# EAGLE design Project Sch (EAGLE 7.5.0)
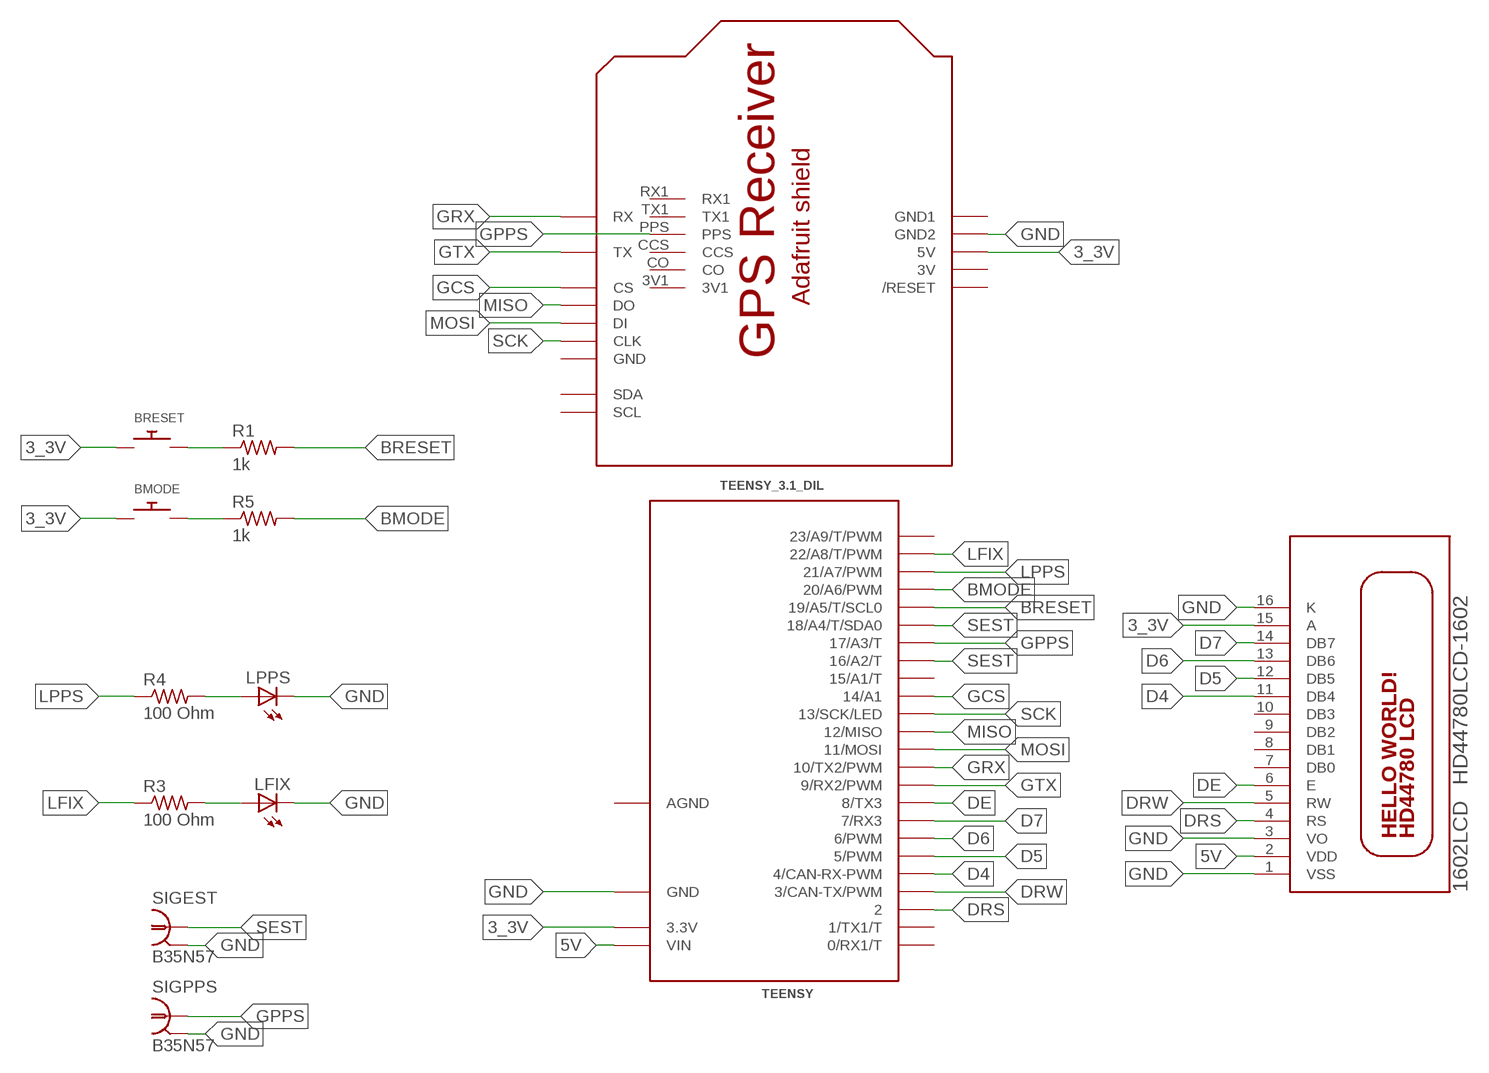
[diagram p0: schematic, sheet 1]

## Parts
1602LCD  HD44780LCD-1602  [LCD1602]
BMODE  SWITCH_PUSHBUTTONEVQ-PE  [TACT_PANA-EVQ]
BRESET  SWITCH_PUSHBUTTONEVQ-PE  [TACT_PANA-EVQ]
LFIX  LED3MM  [LED3MM]
LPPS  LED3MM  [LED3MM]
R1  1k  R-US_0204/7  [0204/7]
R3  100 Ohm  R-US_0204/7  [0204/7]
R4  100 Ohm  R-US_0204/7  [0204/7]
R5  1k  R-US_0204/7  [0204/7]
SIGEST  B35N57  [B35N57]
SIGPPS  B35N57  [B35N57]
TEENSY  TEENSY_3.1_DIL  [TEENSY3-DIL]
U1  ADAFRUIT_GPS_SHIELD-DIMENSION  [ADAFRUIT_GPS_SHIELD]

## Nets
3_3V: 1602LCD.15(A) BMODE.P$1 BRESET.P$1 TEENSY.3.3V U1.5V
5V: 1602LCD.2(VDD) TEENSY.VIN
BMODE: R5.2 TEENSY.20/A6(20/A6/PWM)
BRESET: R1.2 TEENSY.19/A5(19/A5/T/SCL0)
D4: 1602LCD.11(DB4) TEENSY.4(4/CAN-RX-PWM)
D5: 1602LCD.12(DB5) TEENSY.5(5/PWM)
D6: 1602LCD.13(DB6) TEENSY.6(6/PWM)
D7: 1602LCD.14(DB7) TEENSY.7(7/RX3)
DE: 1602LCD.6(E) TEENSY.8(8/TX3)
DRS: 1602LCD.4(RS) TEENSY.2
DRW: 1602LCD.5(RW) TEENSY.3(3/CAN-TX/PWM)
GCS: TEENSY.14/A0(14/A1) U1.CS
GND: 1602LCD.1(VSS) 1602LCD.3(VO) 1602LCD.16(K) LFIX.K(C) LPPS.K(C) SIGEST.2 SIGEST.3 SIGEST.4 SIGEST.5 SIGPPS.2 SIGPPS.3 SIGPPS.4 SIGPPS.5 TEENSY.GND U1.GND2
GPPS: SIGPPS.1 TEENSY.17/A3(17/A3/T) U1.PPS
GRX: TEENSY.10(10/TX2/PWM) U1.RX
GTX: TEENSY.9(9/RX2/PWM) U1.TX
LFIX: R3.1 TEENSY.22/A8(22/A8/T/PWM)
LPPS: R4.1 TEENSY.21/A7(21/A7/PWM)
MISO: TEENSY.12(12/MISO) U1.DO
MOSI: TEENSY.11(11/MOSI) U1.DI
N$1: BRESET.P$2 R1.1
N$3: BMODE.P$2 R5.1
N$4: LFIX.A R3.2
N$5: LPPS.A R4.2
SCK: TEENSY.13(13/SCK/LED) U1.CLK
SEST: SIGEST.1 TEENSY.16/A2(16/A2/T) TEENSY.18/A4(18/A4/T/SDA0)
Unconnected: 1602LCD.7(DB0) 1602LCD.8(DB1) 1602LCD.9(DB2) 1602LCD.10(DB3) TEENSY.0(0/RX1/T) TEENSY.1(1/TX1/T) TEENSY.15/A1(15/A1/T) TEENSY.23/A9(23/A9/T/PWM) U1.3V1 U1./RESET U1.CCS U1.CO U1.RX1 U1.SCL U1.SDA U1.TX1

## Power pins joined to a net without a drawn wire
3V: U1.3V
AGND: TEENSY.AGND
GND: U1.GND
GND1: U1.GND1

## Library data of the parts
1602LCD = adafruit:HD44780LCD: HD44780 LCD Standard character type LCDs, available in sizes from 8x1 to 40x4!
BMODE BRESET = adafruit:SWITCH_PUSHBUTTON: Buttons SOFTTOUCHSMD_SJ - Soft touch temporary push button (Super Junk Akihabara) Compatible with SKPMANE010 [Mouser: 688-SKPMAN] C&K_KSS = Digikey: KSS221GLFS
LFIX LPPS = adafruit:LED: LED OSRAM: - CHIPLED LG R971, LG N971, LY N971, LG Q971, LY Q971, LO R971, LY R971 LH N974, LH R974 LS Q976, LO Q976, LY Q976 LO Q996 - Hyper CHIPLED LW Q18S LB Q993, LB Q99A, LB R99A - SideLED LS A670, LO A670, LY A670, LG A670, LP A670 LB A673, LV A673, LT A673, LW A673 LH A674 LY A675 LS A676, LA A676, LO A676, LY A676, LW A676 LS A679, LY A679, LG A679 - Hyper Micro SIDELED® LS Y876, LA Y876, LO Y876, LY Y876 LT Y87S - SmartLED LW L88C, LW L88S LB L89C, LB L89S, LG L890 LS L89K, LO L89K, LY L89K LS L896, LA L896, LO L896, LY L896 - TOPLED LS T670, LO T670, LY T670, LG T670, LP T670 LSG T670, LSP T670, LSY T670, LOP T670, LYG T670 LG T671, LOG T671, LSG T671 LB T673, LV T673, LT T673, LW T673 LH T674 LS T676, LA T676, LO T676, LY T676, LB T676, LH T676, LSB T676, LW T676 LB T67C, LV T67C, LT T67C, LS T67K, LO T67K, LY T67K, LW E67C LS E67B, LA E67B, LO E67B, LY E67B, LB E67C, LV E67C, LT E67C LW T67C LS T679, LY T679, LG T679 LS T770, LO T770, LY T770, LG T770, LP T770 LB T773, LV T773, LT T773, LW T773 LH T774 LS E675, LA E675, LY E675, LS T675 LS T776, LA T776, LO T776, LY T776, LB T776 LHGB T686 LT T68C, LB T68C - Hyper Mini TOPLED® LB M676 - Mini TOPLED Santana® LG M470 LS M47K, LO M47K, LY M47K Source: http://www.osram.convergy.de/
R1 R3-R5 = adafruit:R-US_: RESISTOR, American symbol
SIGEST SIGPPS = con-coax:B35N57: BNC CONNECTOR M/A COM www.macom.com; OC_FARNELL: unknown; OC_NEWARK: unknown
TEENSY = Teensy_3_and_LC_Series_Boards_v1.1:TEENSY_3.1_DIL: Teensy 3.1 or 3.2 in a DIL Layout.
U1 = AdafruitGPS:ADAFRUIT_GPS_SHIELD: This is the Adafruit GPS logger shield

## Board
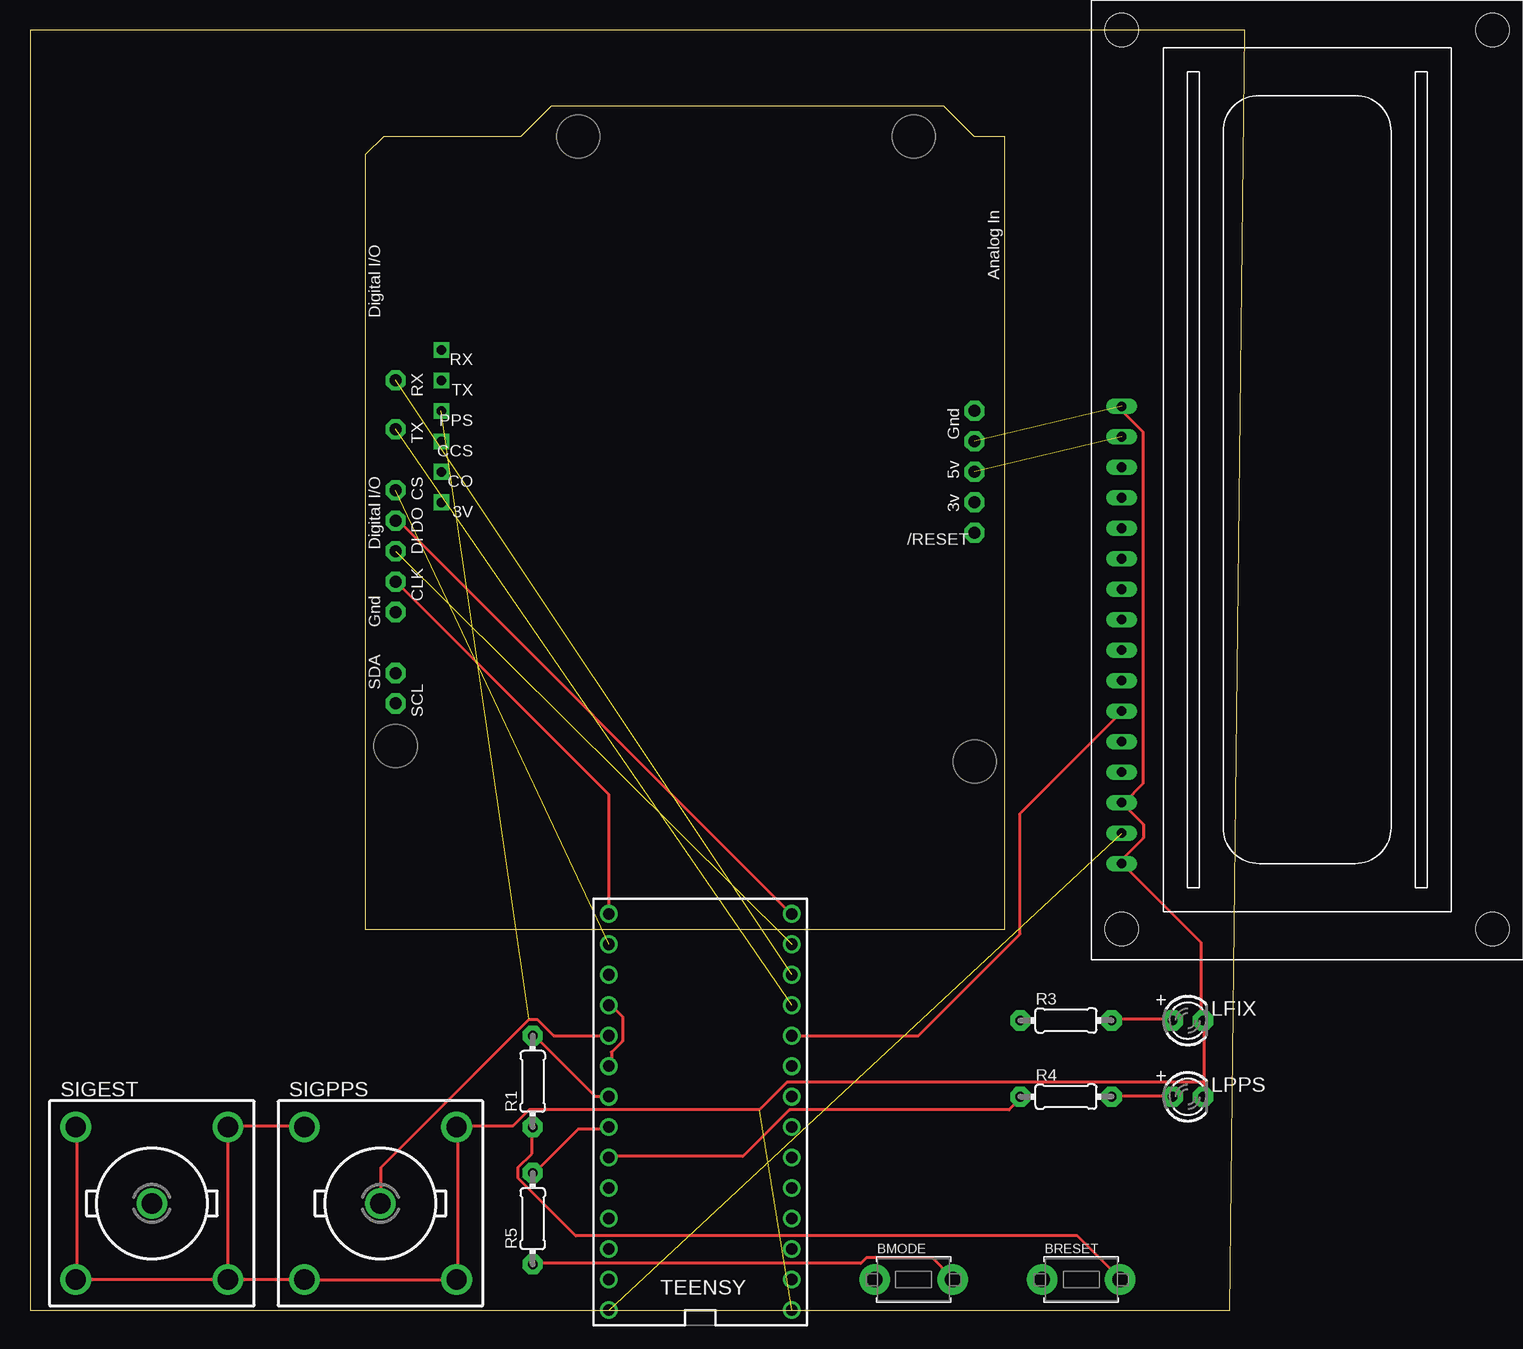
[diagram p1: board, top side]
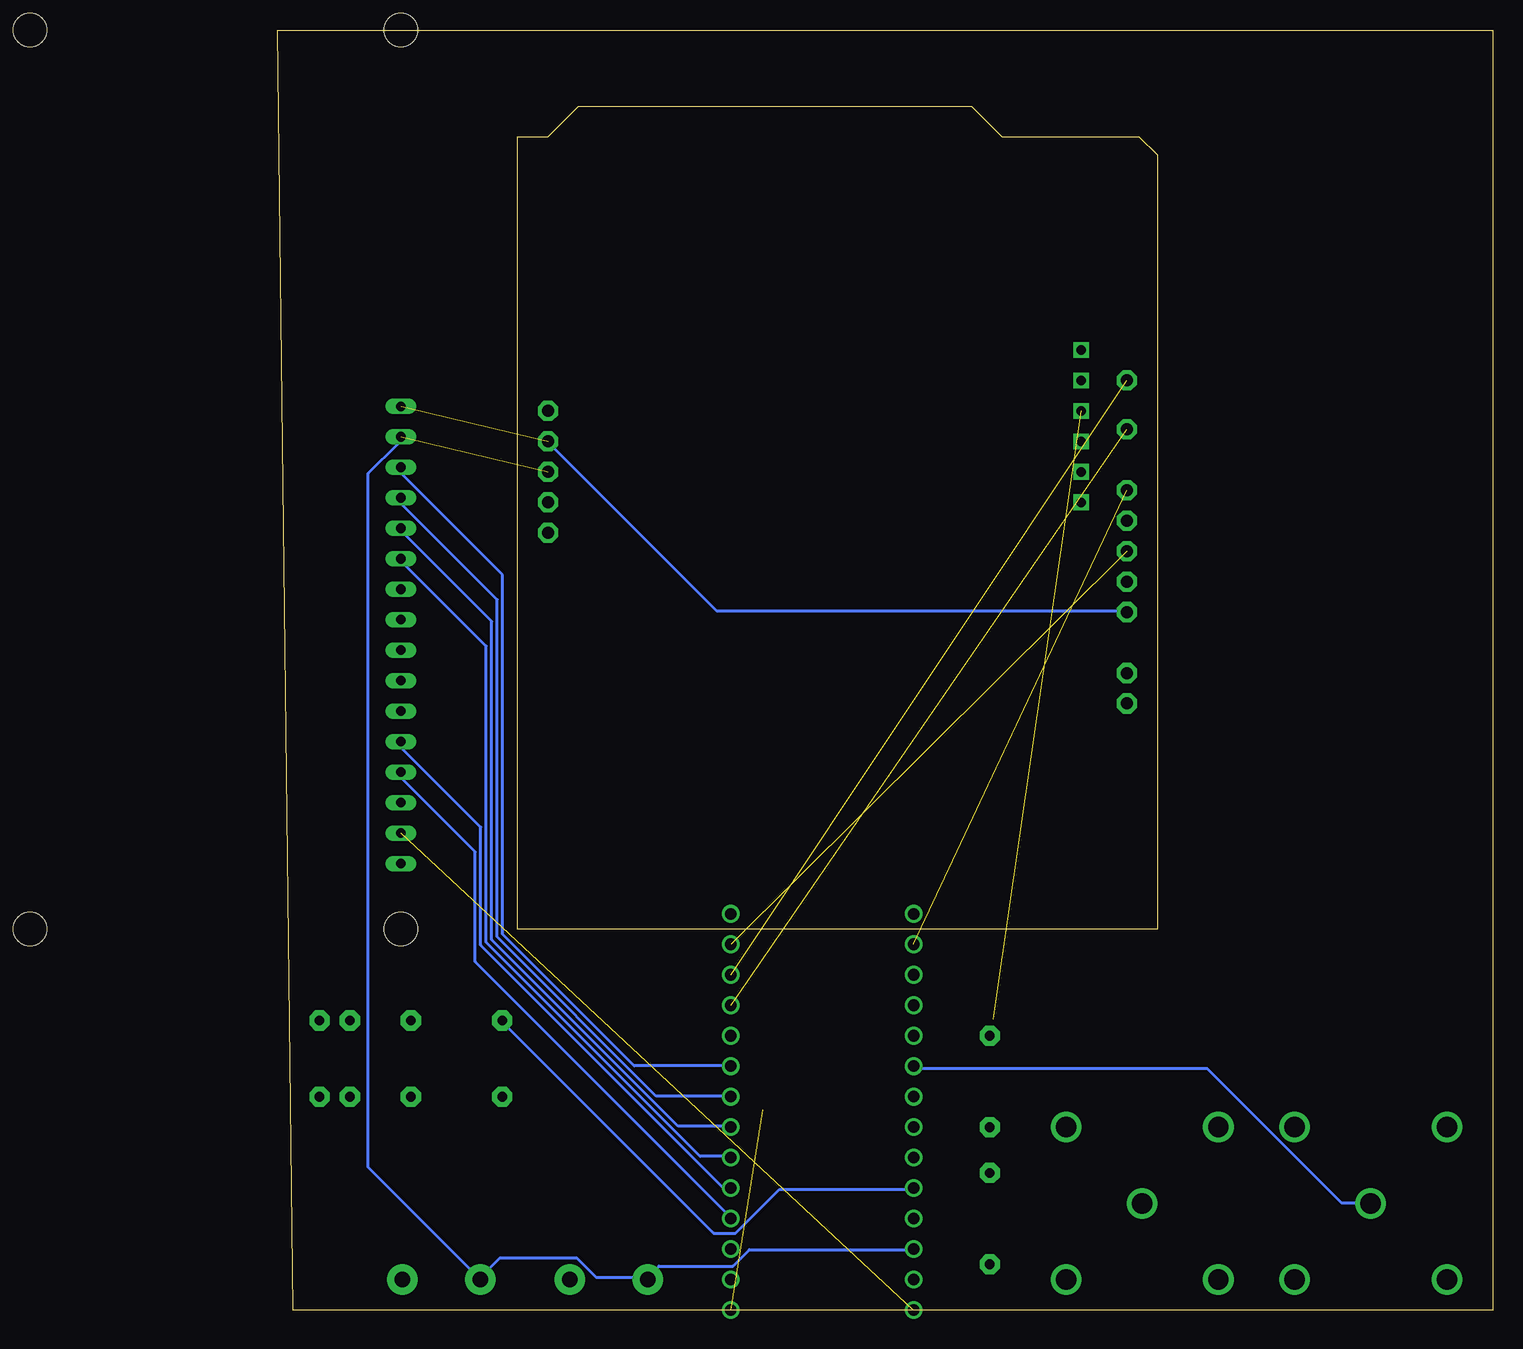
[diagram p2: board, bottom side, seen from below]

Size 101.27 x 106.67 mm. Coordinates in mm from the lower left corner, seen from the top.
Outline: 0,0 100,0 101.27,106.67 0,106.67 0,0
Copper layers (1*16): Top 0.035mm / dielectric 1.5mm / Bottom 0.035mm
Design rules "default": minimum track width 10mil, minimum drill 24mil, track to track 8mil, track to pad 8mil, pad to pad 8mil, via to via 8mil, smd to smd 8mil, copper to edge 40mil, drill to drill 8mil, minimum pad ring 10mil, minimum via ring 8mil, stop-mask expansion 4mil, vias tented up to drill 0mil, thermal gap 10mil

### Footprints (pad centres in the part's own frame; a part is rotated, then mirrored left to right if it is on the bottom)
LCD1602 = drill 0.8 long: 1 8,33.46; 2 10.54,33.46; 3 13.08,33.46; 4 15.62,33.46; 5 18.16,33.46; 6 20.7,33.46; 7 23.24,33.46; 8 25.78,33.46; 9 28.32,33.46; 10 30.86,33.46; 11 33.4,33.46; 12 35.94,33.46; 13 38.48,33.46; 14 41.02,33.46; 15 43.56,33.46; 16 46.1,33.46 | hole 2.8: 2.54,2.54; 2.54,33.46; 77.46,33.46; 77.46,2.54
TACT_PANA-EVQ = drill 1.3 pad 2.54: P$1 -3.25,0; P$2 3.25,0
LED3MM = drill 0.813 pad 1.676 octagon: A -1.27,0; K 1.27,0
0204/7 = drill 0.813 pad 1.676 octagon: 1 -3.81,0; 2 3.81,0
B35N57 = drill 1.7: 1 0,0; 2 6.35,6.35; 3 -6.35,6.35; 4 -6.35,-6.35; 5 6.35,-6.35
TEENSY3-DIL = drill 0.965: 0 -7.62,13.97; 1 -7.62,11.43; 2 -7.62,8.89; 3 -7.62,6.35; 3.3V 7.62,11.43; 4 -7.62,3.81; 5 -7.62,1.27; 6 -7.62,-1.27; 7 -7.62,-3.81; 8 -7.62,-6.35; 9 -7.62,-8.89; 10 -7.62,-11.43; 11 -7.62,-13.97; 12 -7.62,-16.51; 13 7.62,-16.51; 14/A0 7.62,-13.97; 15/A1 7.62,-11.43; 16/A2 7.62,-8.89; 17/A3 7.62,-6.35; 18/A4 7.62,-3.81; 19/A5 7.62,-1.27; 20/A6 7.62,1.27; 21/A7 7.62,3.81; 22/A8 7.62,6.35; 23/A9 7.62,8.89; AGND 7.62,13.97; GND -7.62,16.51; VIN 7.62,16.51
ADAFRUIT_GPS_SHIELD = drill 1 pad 1.676 octagon: 3V 35.56,2.54; 5V 38.1,2.54; /RESET 33.02,2.54; CLK 28.956,50.8; CS 36.576,50.8; DI 31.496,50.8; DO 34.036,50.8; GND 26.416,50.8; GND1 43.18,2.54; GND2 40.64,2.54; RX 45.72,50.8; SCL 18.796,50.8; SDA 21.336,50.8; TX 41.656,50.8 | drill 0.8 square: 3V1 35.56,46.99; CCS 40.64,46.99; CO 38.1,46.99; PPS 43.18,46.99; RX1 48.26,46.99; TX1 45.72,46.99

### Placement (x,y rotation side)
1602LCD  124.46,29.21 90 top
BMODE  73.66,2.54 0 top
BRESET  87.63,2.54 0 top
LFIX  96.52,24.13 0 top
LPPS  96.52,17.78 0 top
R1  41.91,19.05 90 top
R3  86.36,24.13 0 top
R4  86.36,17.78 0 top
R5  41.91,7.62 90 top
SIGEST  10.16,8.89 0 top
SIGPPS  29.21,8.89 0 top
TEENSY  55.88,16.51 180 top
U1  81.28,31.75 90 top

### Tracks (layer width: path | path; a pad name or v marks a point on that pad's centre or on a via)
3_3V  (1 unrouted)
  Bottom 0.254: TEENSY.3.3V 48.46,5.03 61.95,5.03 63.32,3.66 69.49,3.66 70.41,2.74 BMODE.P$1 70.64,2.74 74.75,2.74 76.35,4.34 82.75,4.34 84.35,2.74 BRESET.P$1 84.58,2.74 93.73,11.89 93.73,69.72 91.21,72.24 91.21,72.69 1602LCD.15
5V  (1 unrouted)
BMODE
  Top 0.254: TEENSY.20/A6 48.23,15.09 45.72,15.09 42.06,11.43 R5.2
BRESET
  Top 0.254: TEENSY.19/A5 48.23,17.83 47.09,17.83 42.06,22.86 R1.2
D4
  Bottom 0.254: 1602LCD.11 90.98,62.41 83.9,55.32 83.9,30.63 66.06,12.8 63.55,12.8 TEENSY.4
D5
  Bottom 0.254: 1602LCD.12 90.98,64.92 83.44,57.38 83.44,30.86 67.89,15.32 63.55,15.32 TEENSY.5
D6
  Bottom 0.254: 1602LCD.13 90.98,67.67 90.98,67.21 82.98,59.21 82.98,31.09 69.72,17.83 63.55,17.83 TEENSY.6
D7
  Bottom 0.254: 1602LCD.14 90.98,70.18 90.98,69.72 82.53,61.27 82.53,31.32 71.55,20.34 63.55,20.34 TEENSY.7
DE
  Top 0.254: TEENSY.8 74.07,22.86 82.53,31.32 82.53,41.38 90.98,49.84 1602LCD.6
DRS
  Bottom 0.254: 1602LCD.4 90.98,44.81 90.98,44.35 84.81,38.18 84.81,29.03 63.55,7.77 TEENSY.2
DRW
  Bottom 0.254: 1602LCD.5 90.98,47.32 90.98,46.86 84.35,40.23 84.35,30.4 64.24,10.29 63.55,10.29 TEENSY.3
GCS  (1 unrouted)
GND  (2 unrouted)
  Top 0.254: SIGEST.3 3.89,15.09 3.89,2.74 SIGEST.4 3.89,2.52 16.46,2.52 SIGEST.5 | 22.86,2.52 16.69,2.52 SIGEST.5 | SIGPPS.3 22.86,15.32 16.69,15.32 SIGEST.2 16.46,15.09 16.46,2.74 SIGEST.5 | 22.86,2.52 35.43,2.52 SIGPPS.5 35.66,2.74 35.66,15.09 SIGPPS.2 35.66,15.32 40.23,15.32 41.6,16.69 60.81,16.69 63.09,18.97 97.84,18.97 | 22.86,2.52 SIGPPS.4 | 97.84,18.97 97.84,24 LFIX.K 97.61,24.23 97.61,30.63 91.21,37.03 1602LCD.1 91.21,37.26 91.21,37.72 92.81,39.32 92.81,40.46 91.21,42.06 1602LCD.3 91.21,42.29 92.81,43.89 92.81,73.15 91.21,74.75 91.21,75.21 1602LCD.16 | 97.84,18.97 97.84,17.83 LPPS.K
  Bottom 0.254: U1.GND 30.63,58.29 64.69,58.29 78.64,72.24 U1.GND2
GPPS  (1 unrouted)
  Top 0.254: TEENSY.17/A3 43.66,22.86 42.29,24.23 41.6,24.23 29.26,11.89 29.26,8.91 SIGPPS.1
GRX  (1 unrouted)
GTX  (1 unrouted)
LFIX
  Bottom 0.254: TEENSY.22/A8 48.46,10.06 59.44,10.06 63.09,6.4 64.92,6.4 82.53,24 R3.1
LPPS
  Top 0.254: TEENSY.21/A7 48.46,12.8 59.44,12.8 63.32,16.69 81.61,16.69 82.53,17.6 R4.1
MISO
  Top 0.254: TEENSY.12 63.32,33.15 30.63,65.84 U1.DO
MOSI  (1 unrouted)
N$1
  Top 0.254: R1.1 41.83,15.09 41.83,13.03 40.69,11.89 40.69,10.97 45.49,6.17 87.33,6.17 90.75,2.74 BRESET.P$2
N$3
  Top 0.254: R5.1 42.06,3.89 69.27,3.89 69.72,4.34 75.21,4.34 76.81,2.74 BMODE.P$2
N$4
  Top 0.254: R3.2 90.3,24.23 95.1,24.23 LFIX.A
N$5
  Top 0.254: R4.2 90.3,17.83 95.1,17.83 LPPS.A
SCK
  Top 0.254: TEENSY.13 48.23,33.15 48.23,42.98 30.63,60.58 U1.CLK
SEST
  Top 0.254: TEENSY.18/A4 48.46,20.34 48.46,21.49 49.38,22.4 49.38,24.46 48.46,25.38 TEENSY.16/A2
  Bottom 0.254: TEENSY.18/A4 48.23,20.12 23.77,20.12 12.57,8.91 10.29,8.91 SIGEST.1